# Altium schematic sheet rxtx_switch.SchDoc
size A4
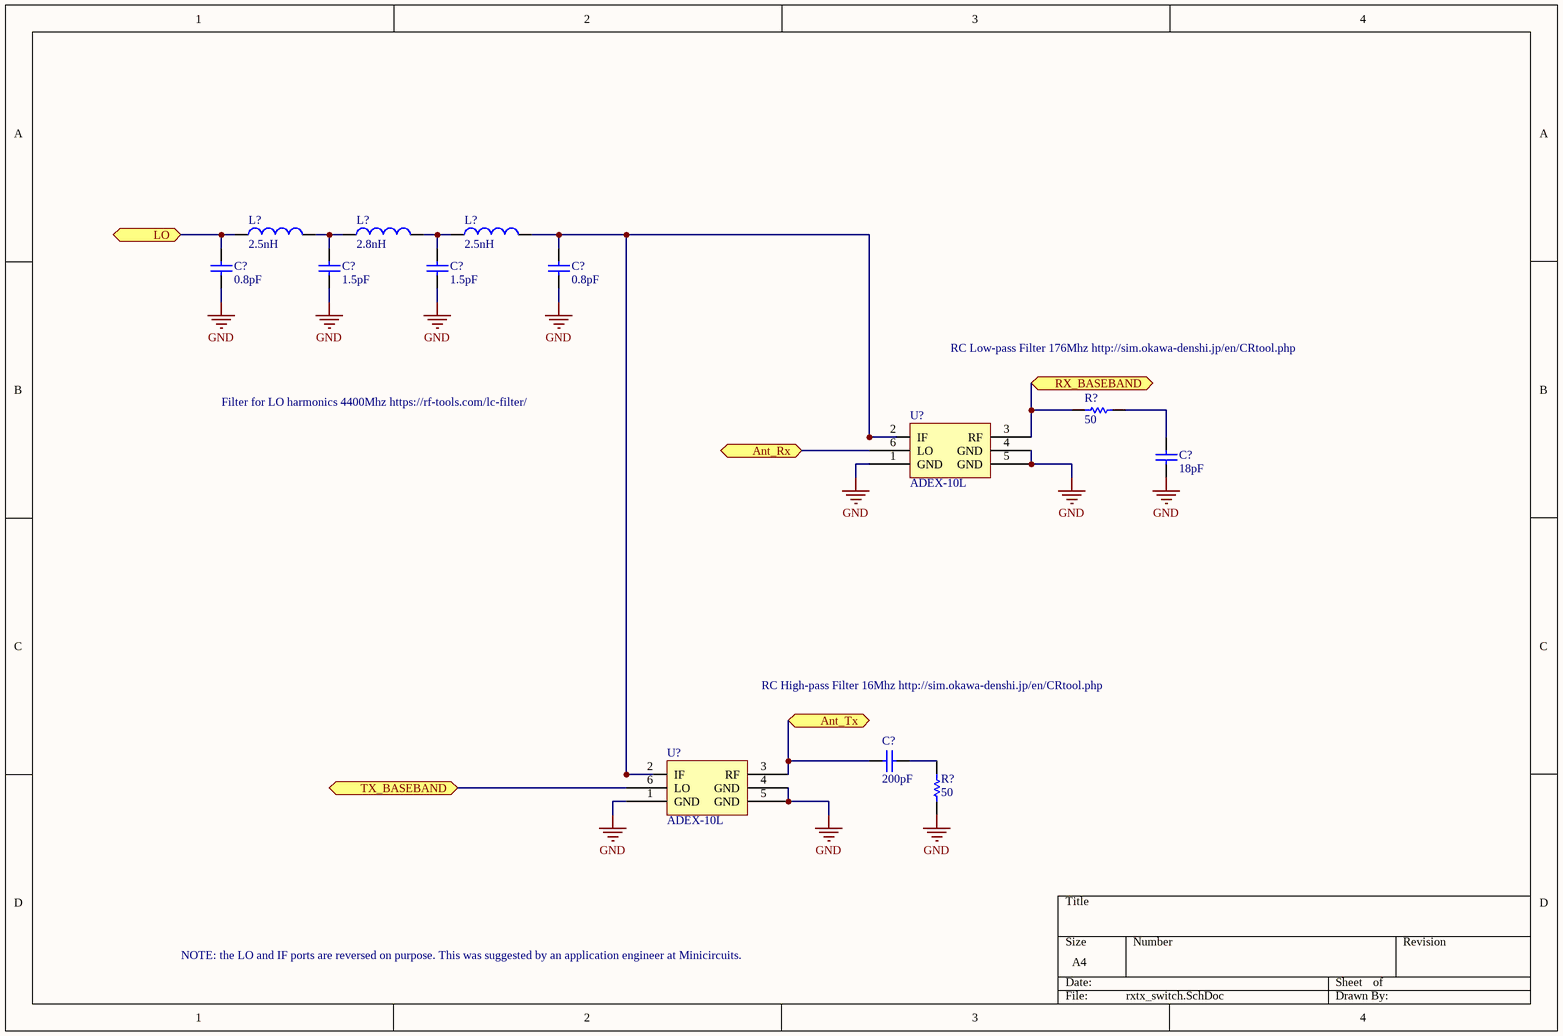
[diagram p0: rxtx_switch.SchDoc]

## Parts
(Parts that share a designator on the sheet are numbered #1, #2 ... from top to bottom, then left to right.)
C?#1  value 0.8pF  [0402]  (hidden comment: Cap Semi)
C?#2  value 1.5pF  [0402]  (hidden comment: Cap Semi)
C?#3  value 1.5pF  [0402]  (hidden comment: Cap Semi)
C?#4  value 0.8pF  [0402]  (hidden comment: Cap Semi)
C?#5  value 18pF  [0402]  (hidden comment: Cap Semi)
C?#6  value 200pF  [0402]  (hidden comment: Cap Semi)
L?#1  value 2.5nH  [0402]  (hidden comment: Inductor)
L?#2  value 2.8nH  [0402]  (hidden comment: Inductor)
L?#3  value 2.5nH  [0402]  (hidden comment: Inductor)
R?#1  value 50  [0402]  (hidden comment: Res Semi)
R?#2  value 50  [0402]  (hidden comment: Res Semi)
U?#1  ADEX-10L
U?#2  ADEX-10L

## Ports
Ant_Rx, Ant_Tx, LO, RX_BASEBAND, TX_BASEBAND

## Nets
GND: C?#1.2 C?#2.2 C?#3.2 C?#4.2 C?#5.2 R?#2.1 U?#1.1(GND) U?#1.4(GND) U?#1.5(GND) U?#2.1(GND) U?#2.4(GND) U?#2.5(GND)
Ant_Rx: U?#1.6(LO) ; port Ant_Rx
Ant_Tx: C?#6.1 U?#2.3(RF) ; port Ant_Tx
LO: C?#1.1 L?#1.1 ; port LO
RX_BASEBAND: R?#1.1 U?#1.3(RF) ; port RX_BASEBAND
TX_BASEBAND: U?#2.6(LO) ; port TX_BASEBAND
NetC?#2_1: C?#2.1 L?#1.2 L?#2.1
NetC?#3_1: C?#3.1 L?#2.2 L?#3.1
NetC?#4_1: C?#4.1 L?#3.2 U?#1.2(IF) U?#2.2(IF)
NetC?#5_1: C?#5.1 R?#1.2
NetC?#6_2: C?#6.2 R?#2.2

## Notes on the sheet
- RC Low-pass Filter 176Mhz http://sim.okawa-denshi.jp/en/CRtool.php
- Filter for LO harmonics 4400Mhz https://rf-tools.com/lc-filter/
- RC High-pass Filter 16Mhz http://sim.okawa-denshi.jp/en/CRtool.php
- NOTE: the LO and IF ports are reversed on purpose. This was suggested by an application engineer at Minicircuits.

## Library data of the parts
C?#1-C?#6 = Cap Semi: Capacitor (Semiconductor SIM Model); Published: 8-Jun-2000; LatestRevisionDate: 29-May-2009; LatestRevisionNote: IPC-7351 Footprint Added.; PackageReference: C1206; Publisher: Altium Limited; PackageDescription: Chip Capacitor
L?#1-L?#3 = Inductor: Code_IEC: 1005; Published: 8-Jun-2000; LatestRevisionDate: 29-May-2009; LatestRevisionNote: IPC-7351 Footprint Added.; PackageReference: 0402-A; Publisher: Altium Limited; PackageDescription: Chip Inductor; Code_JEITA: 0402
R?#1 R?#2 = Res Semi: Semiconductor Resistor; Published: 8-Jun-2000; LatestRevisionDate: 17-Jul-2002; LatestRevisionNote: Re-released for DXP Platform.; PackageReference: AXIAL-0.5; Publisher: Altium Limited; PackageDescription: Axial Device, Thru-Hole; 2 Leads; 0.5 in Pin Spacing
U?#1 U?#2 = ADEX-10L: Passive Mixer